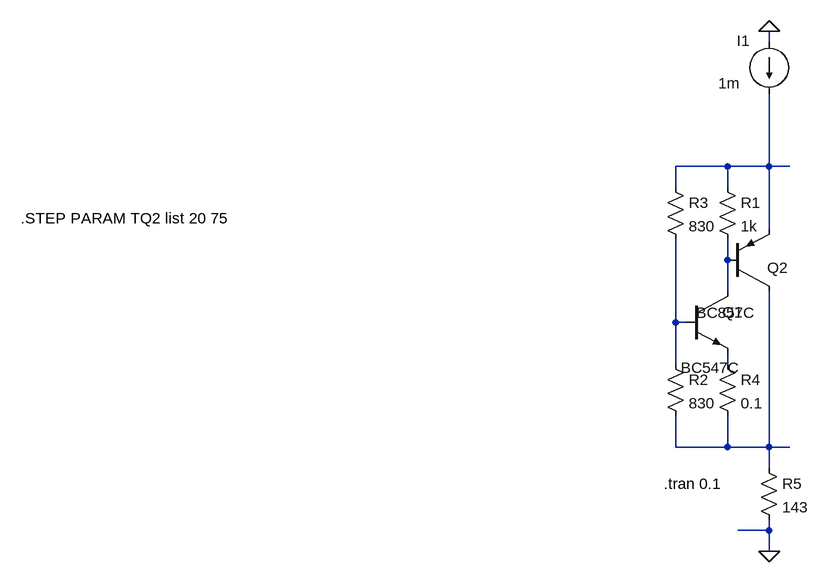
[diagram p0: schematic vbe_multiplier.asc]
vbe_multiplier.asc, the LTspice schematic file:
Version 4
SHEET 1 880 692
WIRE 176 -240 176 -256
WIRE 112 -48 32 -48
WIRE 176 -48 176 -160
WIRE 176 -48 112 -48
WIRE 208 -48 176 -48
WIRE 32 -16 32 -48
WIRE 112 -16 112 -48
WIRE 176 48 176 -48
WIRE 112 96 112 64
WIRE 112 144 112 96
WIRE 32 192 32 64
WIRE 48 192 32 192
WIRE 32 256 32 192
WIRE 112 256 112 240
WIRE 32 384 32 336
WIRE 112 384 112 336
WIRE 112 384 32 384
WIRE 176 384 176 144
WIRE 176 384 112 384
WIRE 208 384 176 384
WIRE 176 416 176 384
WIRE 176 512 176 496
WIRE 176 512 128 512
WIRE 176 544 176 512
FLAG 176 -256 0
FLAG 176 544 0
SYMBOL npn 48 144 R0
WINDOW 3 -8 118 Left 2
SYMATTR Value BC547C
SYMATTR InstName Q1
SYMATTR SpiceLine TEMP {TQ2}
SYMBOL pnp 112 144 M180
WINDOW 0 61 36 Left 2
WINDOW 3 -48 -33 Left 2
SYMATTR InstName Q2
SYMATTR Value BC857C
SYMATTR SpiceLine TEMP {TQ2}
SYMBOL res 96 -32 R0
SYMATTR InstName R1
SYMATTR Value 1k
SYMBOL res 16 240 R0
SYMATTR InstName R2
SYMATTR Value 830
SYMBOL res 16 -32 R0
SYMATTR InstName R3
SYMATTR Value 830
SYMBOL current 176 -240 R0
WINDOW 0 -50 -1 Left 2
WINDOW 3 -78 64 Left 2
WINDOW 123 0 0 Left 0
WINDOW 39 0 0 Left 0
SYMATTR InstName I1
SYMATTR Value 1m
SYMBOL res 96 240 R0
SYMATTR InstName R4
SYMATTR Value 0.1
SYMBOL res 160 400 R0
SYMATTR InstName R5
SYMATTR Value 143
TEXT 14 440 Left 2 !.tran 0.1
TEXT -976 32 Left 2 !.STEP PARAM TQ2 list 20 75

The netlist it stands for:
* vbe_multiplier.asc
Q1 N002 N003 N004 0 BC547C TEMP {TQ2}
Q2 N005 N002 N001 0 BC857C TEMP {TQ2}
R1 N001 N002 1k
R2 N003 N005 830
R3 N001 N003 830
I1 0 N001 1m
R4 N004 N005 0.1
R5 N005 0 143
.model NPN NPN
.model PNP PNP
.lib standard.bjt
.tran 0.1
.STEP PARAM TQ2 list 20 75
.backanno
.end